# EasyEDA schematic HV_OPTO_METER.json
TITLE: Sheet_1; REV: 1.0; Date: 2025-03-03; Sheet: 1/1; Drawn By: AmirB; Company: Your Company
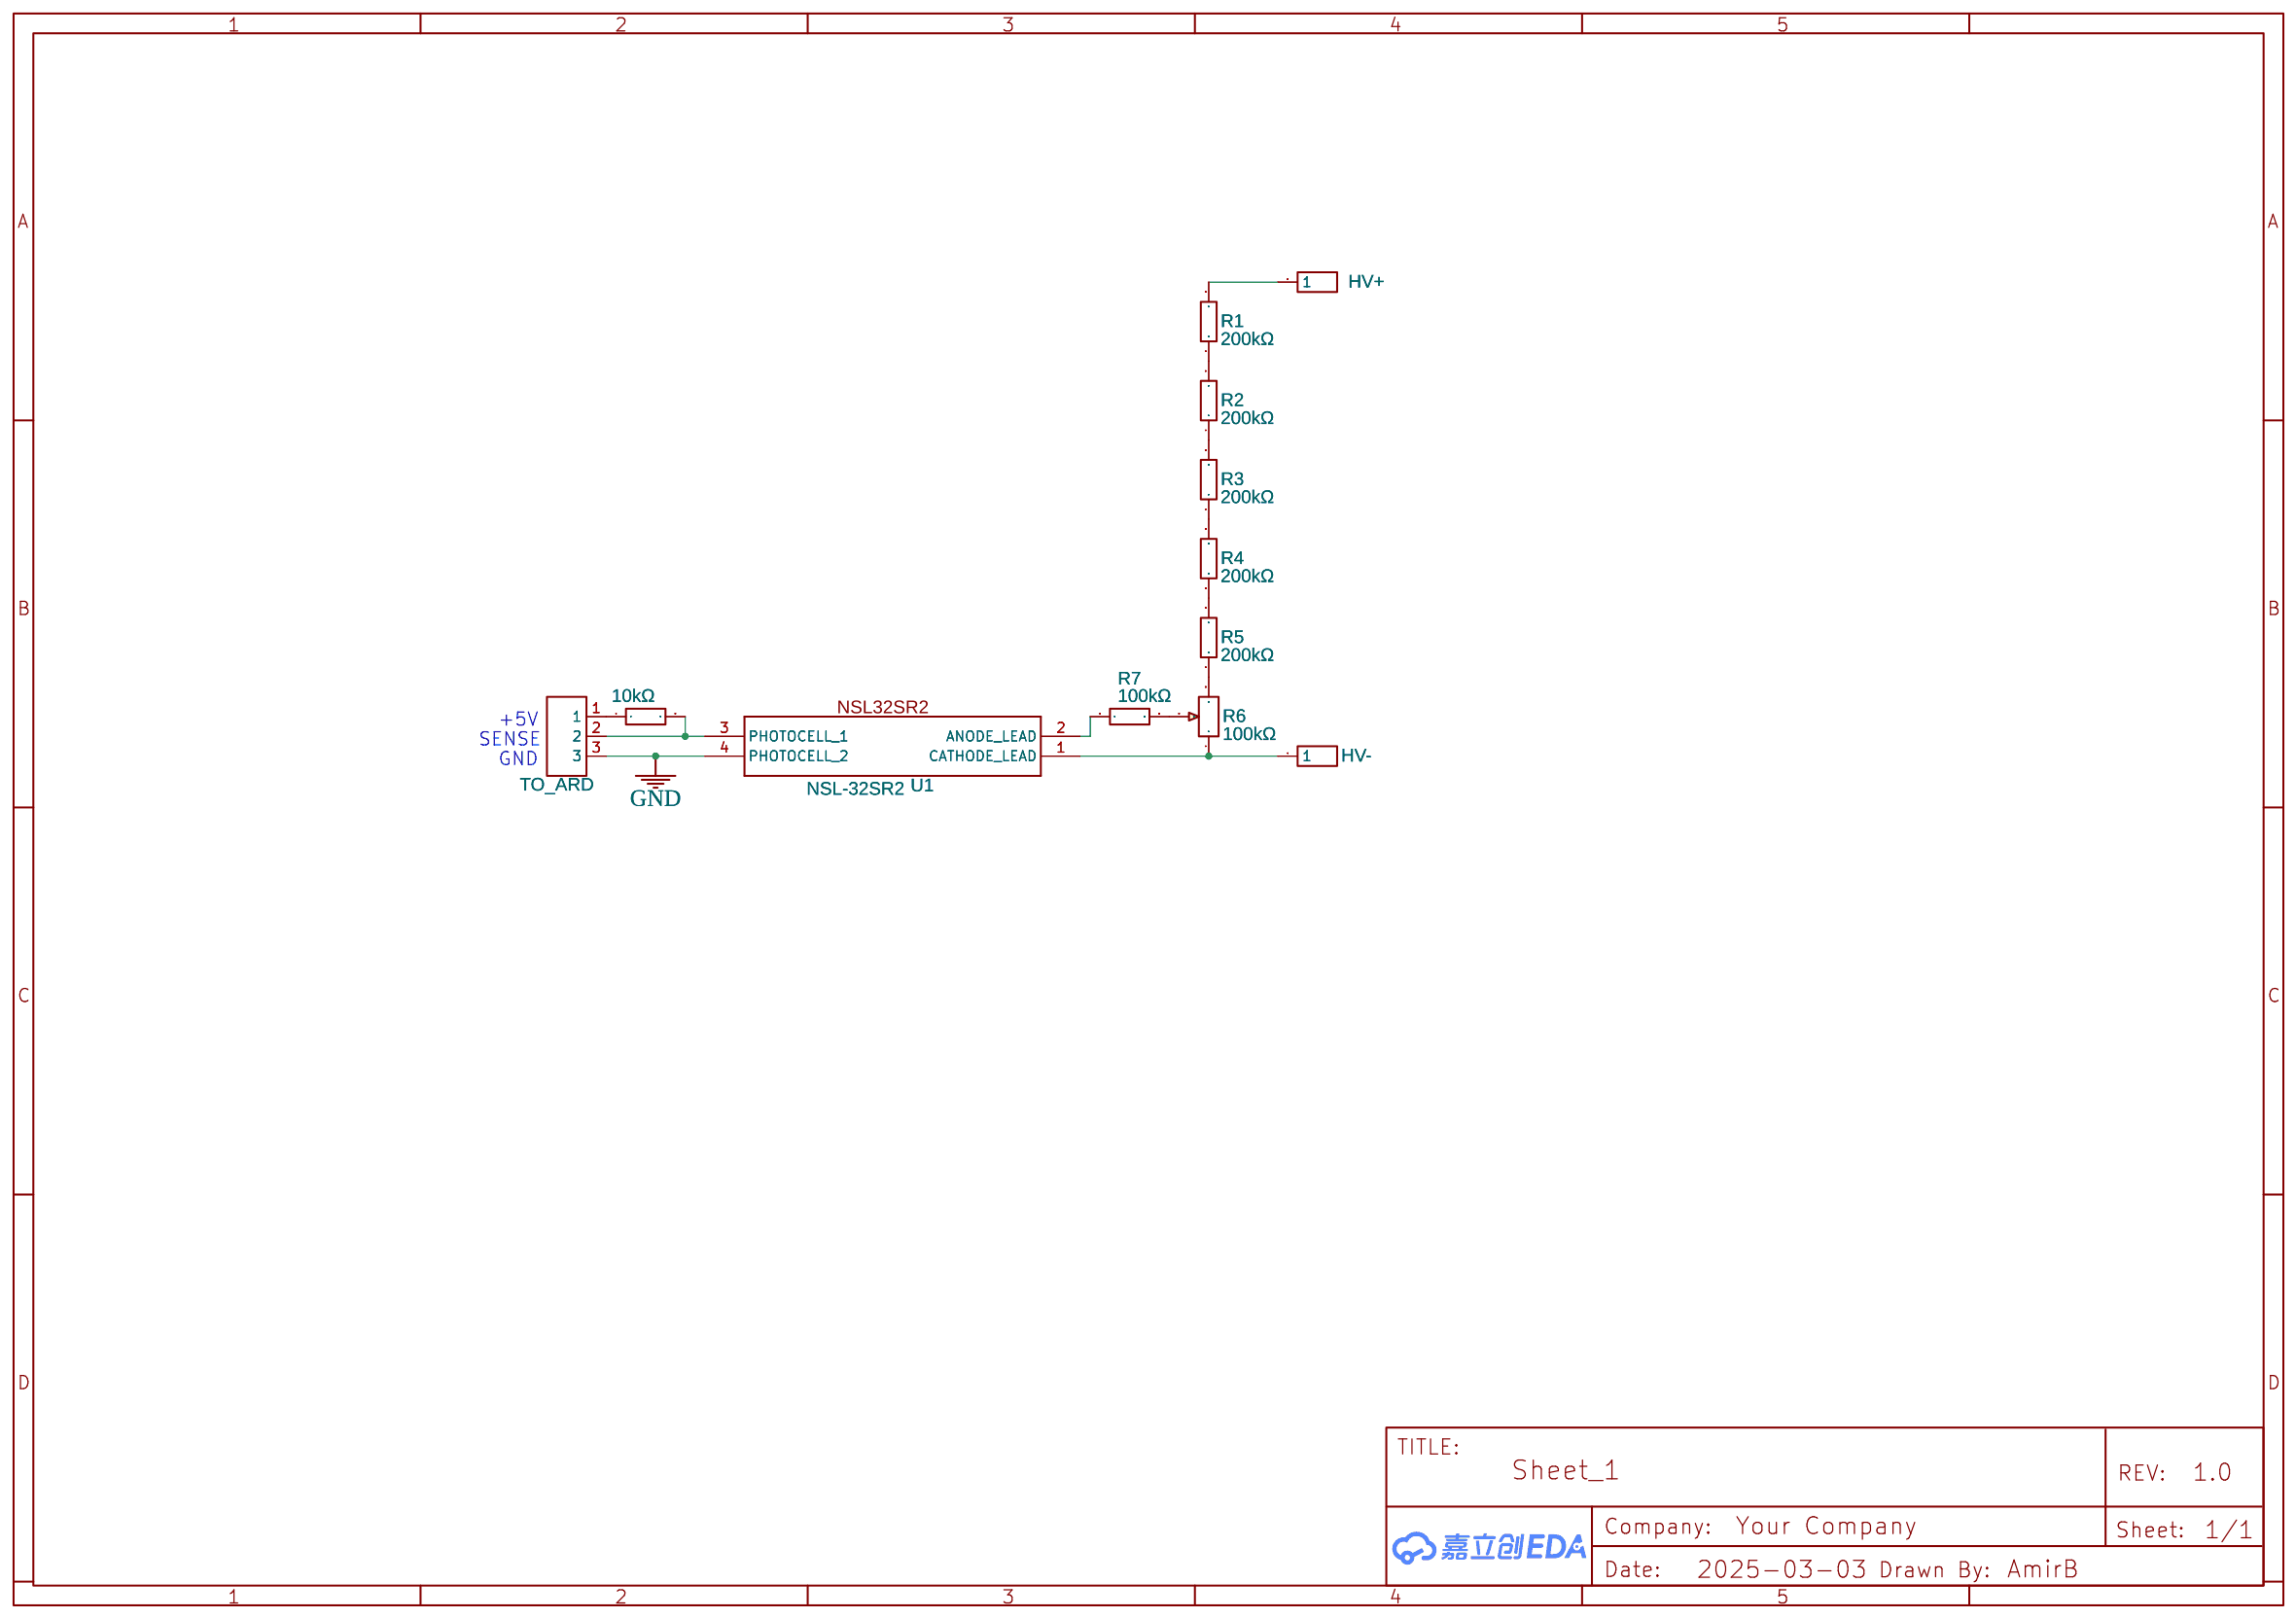
[diagram p0: schematic sheet]

## Parts
J1  HV+  [HDR-M-2.54_1X1]
J2  HV-  [HDR-M-2.54_1X1]
R1  200kΩ  [RES-TH_BD3.3-L9.0-P13.00-D0.6]
R2  200kΩ  [RES-TH_BD3.3-L9.0-P13.00-D0.6]
R3  200kΩ  [RES-TH_BD3.3-L9.0-P13.00-D0.6]
R4  200kΩ  [RES-TH_BD3.3-L9.0-P13.00-D0.6]
R5  200kΩ  [RES-TH_BD3.3-L9.0-P13.00-D0.6]
R6  100kΩ  [RES-ADJ-TH_3P-L9.5-W4.9-P2.50-L_3296W]
R7  100kΩ  [R0805]
RPUP  10kΩ  [R0603]
TO_ARD  FK2510  [CONN-TH_3P-P2.00_KF2510_3A]
U1  NSL-32SR2  [NSL32SR2]

## Library data of the parts
J1 J2 = HDR-M-2.54_1x1: Supplier Part: C81276; Supplier: LCSC; Contributor: LCEDA_Lib; Package Display: No
R1-R5 = RN1/2W200KΩFT/BA1: Contributor: LCSC; Supplier: LCSC; Supplier Part: C385591; Manufacturer: Tyohm(幸亚电阻); JLCPCB Part Class: Extended Part; Package Display: No
R6 = 3296W-1-104: Resistance(Ohms): 100K; Contributor: LCSC; Supplier: LCSC; Supplier Part: C118963; Manufacturer: BOCHEN(博晨); JLCPCB Part Class: Extended Part; Package Display: No
R7 = 0805W8F1003T5E_C149504: Contributor: LCSC; Supplier: LCSC; Supplier Part: C149504; Manufacturer: UNI-ROYAL(厚声); JLCPCB Part Class: Basic Part; Package Display: No
RPUP = 0603WAF1002T5E: Supplier: LCSC; Manufacturer: UNI-ROYAL(厚声); Supplier Part: C25804; Resistance (Ohms): 10K; JLCPCB Part Class: Basic Part; Package Display: No
TO_ARD = kf2510_3A: JLCPCB Part Class: Extended Part; Package Display: No
U1 = NSL-32SR2: Contributor: PaoloCognigni; Package Display: Yes

## Nets
GND: TO_ARD.3 U1.4(PHOTOCELL_2)
Net-(J1-1): J1.1 R1.2
Net-(J2-1): J2.1 R6.1 U1.1(CATHODE_LEAD)
Net-(R1-1): R1.1 R2.2
Net-(R2-1): R2.1 R3.2
Net-(R3-1): R3.1 R4.2
Net-(R4-1): R4.1 R5.2
Net-(R5-1): R5.1 R6.3
Net-(R6-2): R6.2 R7.2
Net-(R7-1): R7.1 U1.2(ANODE_LEAD)
Net-(RPUP-1): RPUP.1 TO_ARD.1
Net-(RPUP-2): RPUP.2 TO_ARD.2 U1.3(PHOTOCELL_1)

## Notes on the sheet
- +5V
- SENSE
- GND
